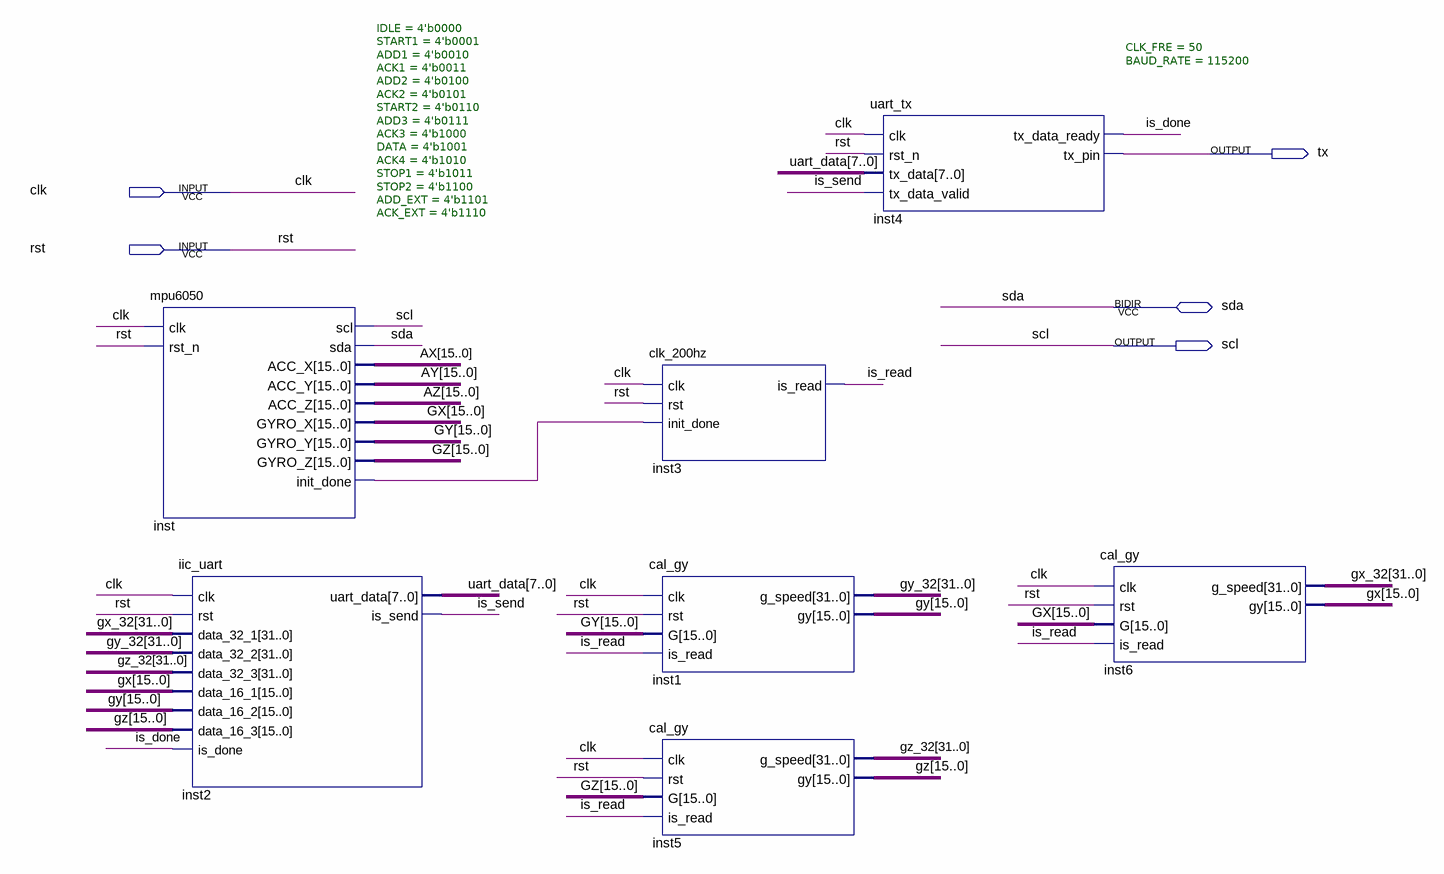
[diagram p0: schematic sheet]
// Quartus schematic GY521.bdf as structural Verilog: 7 symbols, 5 pins
module GY521 (
  input  clk,
  input  rst,
  inout  sda,
  output tx,
  output scl
);

  wire inst_init_done, is_done, is_read, is_send;
  wire [7:0] uart_data;
  wire [15:0] AX, AY, AZ, GX, GY, GZ;
  wire [31:0] gx_32, gy_32, gz_32;

  mpu6050 #(.IDLE(4'b0000), .START1(4'b0001), .ADD1(4'b0010), .ACK1(4'b0011), .ADD2(4'b0100), .ACK2(4'b0101), .START2(4'b0110), .ADD3(4'b0111), .ACK3(4'b1000), .DATA(4'b1001), .ACK4(4'b1010), .STOP1(4'b1011), .STOP2(4'b1100), .ADD_EXT(4'b1101), .ACK_EXT(4'b1110)) inst (
    .clk(clk), .rst_n(rst), .scl(scl), .ACC_X(AX), .ACC_Y(AY), .ACC_Z(AZ), .GYRO_X(GX), .GYRO_Y(GY),
    .GYRO_Z(GZ), .init_done(inst_init_done), .sda(sda));
  iic_uart inst2 (
    .clk(clk), .rst(rst), .data_32_1(gx_32), .data_32_2(gy_32), .data_32_3(gz_32), .data_16_1(GX),
    .data_16_2(GY), .data_16_3(GZ), .is_done(is_done), .uart_data(uart_data), .is_send(is_send));
  clk_200hz inst3 (.clk(clk), .rst(rst), .init_done(inst_init_done), .is_read(is_read));
  cal_gy inst1 (.clk(clk), .rst(rst), .G(GY), .is_read(is_read), .g_speed(gy_32), .gy(GY));
  cal_gy inst5 (.clk(clk), .rst(rst), .G(GZ), .is_read(is_read), .g_speed(gz_32), .gy(GZ));
  uart_tx #(.CLK_FRE(50), .BAUD_RATE(115200)) inst4 (
    .clk(clk), .rst_n(rst), .tx_data(uart_data), .tx_data_valid(is_send), .tx_data_ready(is_done), .tx_pin(tx));
  cal_gy inst6 (.clk(clk), .rst(rst), .G(GX), .is_read(is_read), .g_speed(gx_32), .gy(GX));
endmodule
